# EAGLE board PCB (EAGLE 9.6.2), part 1 of 2
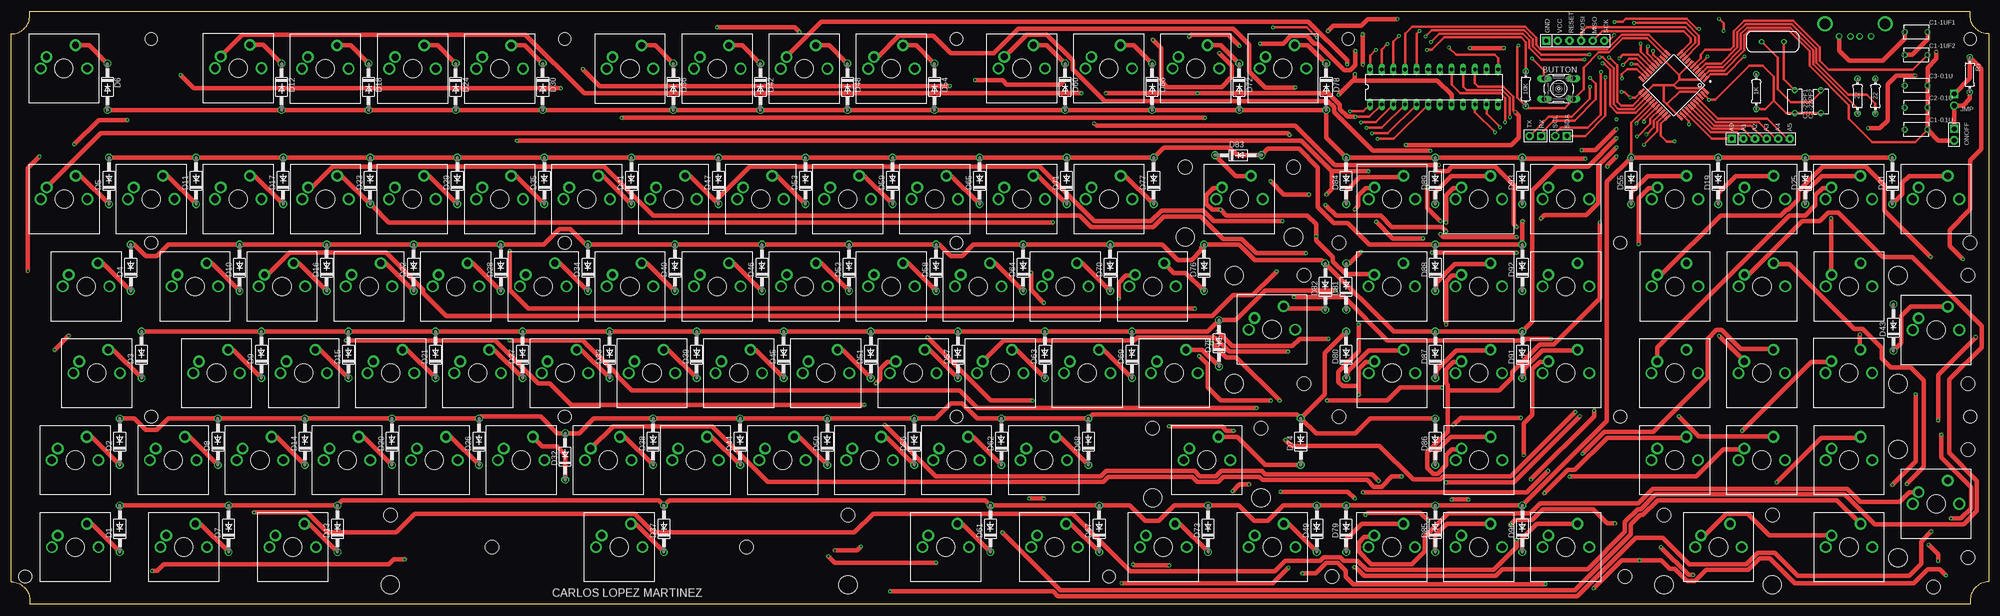
[diagram p2: board, top side]
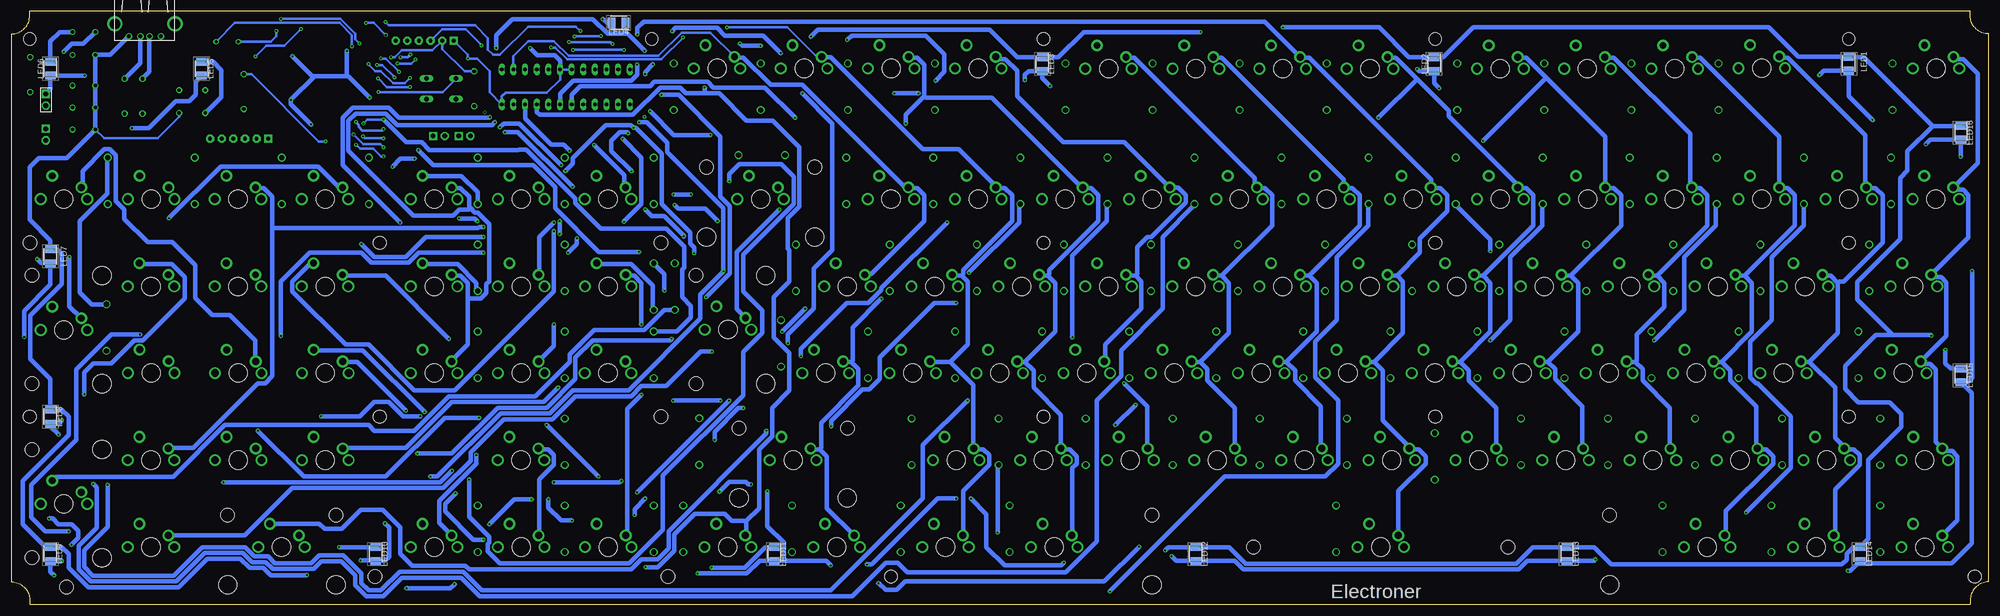
[diagram p3: board, bottom side, seen from below]

Size 431.5 x 129.5 mm. Coordinates in mm from the lower left corner, seen from the top.
Outline: 431.5,124.6 431.5,4.9 arc90 427.5,0.9 427.5,0 4,0 4,0.9 arc90 0,4.9 0,124.6 arc90 4,128.6 4,129.5 427.5,129.5 427.5,128.6 arc90 431.5,124.6
Copper layers (1*16): Top 0.035mm / dielectric 1.5mm / Bottom 0.035mm
Design rules "default *": minimum track width 0.5mm, minimum drill 0.35mm, track to track 10mil, track to pad 10mil, pad to pad 7mil, via to via 10mil, smd to smd 7mil, copper to edge 40mil, drill to drill 6mil, minimum pad ring 10mil, minimum via ring 8mil, stop-mask expansion 4mil, vias tented up to drill 0mil, thermal gap 10mil
Net classes: 0 default: width 0.203 mm
Holes 2.75 mm at 30.5,123.47 120.75,123.47 206.25,123.46 291.75,123.46 427.5,123.47
Holes 2.8 mm at 351.13,79 427.5,41 351.13,41 239.5,6.04 3,6.03 30.51,78.99 120.75,79 206.25,78.99 206.26,41 120.76,41 30.5,40.99
Holes 3 mm at 82.7,19.5 182.55,19.5 384.32,19.5 360.68,19.5 427,33.82 427,10.18 427,48.18 427,71.83 272.7,38.5 249.05,38.5 282.13,48.18 282.12,71.83 279.82,95.5 256.18,95.5 289.75,78.99 419.5,3.78 352.16,6.04 288.19,6.04 289.75,41 160.43,12.5 104.83,12.5 427.5,79
Holes 4 mm at 82.7,4.25 182.57,4.25 384.32,4.25 360.68,4.24 411.74,10.17 411.74,33.82 411.74,48.18 411.75,71.82 272.7,23.25 249.05,23.25 266.87,48.18 266.87,71.83 256.18,80.25 279.82,80.24

## Footprints (pad centres in the part's own frame; a part is rotated, then mirrored left to right if it is on the bottom)
SIP-100-06-32 = drill 0.813 pad 1.778 square: 1 -6.35,0 | drill 0.813 pad 1.778 octagon: 2 -3.81,0; 3 -1.27,0; 4 1.27,0; 5 3.81,0; 6 6.35,0
B3F-10XX = drill 1.016 long: 1 -3.251,2.261; 2 3.251,2.261; 3 -3.251,-2.261; 4 3.251,-2.261
CAP_RDE5C1H273J2M1H03A = drill 0.75 pad 1.15: 1 -2.5,0; 2 2.5,0
DO41-10 = drill 1.118: A 5.08,0; C -5.08,0
CHERRY-MX = drill 1.714 pad 1.93: P$3 -5.08,0; P$4 5.08,0 | drill 1.5 pad 2.54: SW1 -3.81,2.54; SW2 2.54,5.08 | hole 4: 0,0
LEDM3528X200N = smd 1.65 x 2.25: 1 -1.5,0; 2 1.5,0
SIP-100-02-40 = drill 1.016 pad 1.778 square: 1 -1.27,0 | drill 1.016 pad 1.778 octagon: 2 1.27,0
DIL24-3 = drill 0.813 long: 1 -13.97,-3.81; 2 -11.43,-3.81; 3 -8.89,-3.81; 4 -6.35,-3.81; 5 -3.81,-3.81; 6 -1.27,-3.81; 7 1.27,-3.81; 8 3.81,-3.81; 9 6.35,-3.81; 10 8.89,-3.81; 11 11.43,-3.81; 12 13.97,-3.81; 13 13.97,3.81; 14 11.43,3.81; 15 8.89,3.81; 16 6.35,3.81; 17 3.81,3.81; 18 1.27,3.81; 19 -1.27,3.81; 20 -3.81,3.81; 21 -6.35,3.81; 22 -8.89,3.81; 23 -11.43,3.81; 24 -13.97,3.81
0204/7 = drill 0.813 octagon: 1 -3.81,0; 2 3.81,0
QFP80P1200X1200X120-44N = smd 1.5 x 0.5: 1 -5.9,4; 2 -5.9,3.2; 3 -5.9,2.4; 4 -5.9,1.6; 5 -5.9,0.8; 6 -5.9,0; 7 -5.9,-0.8; 8 -5.9,-1.6; 9 -5.9,-2.4; 10 -5.9,-3.2; 11 -5.9,-4; 23 5.9,-4; 24 5.9,-3.2; 25 5.9,-2.4; 26 5.9,-1.6; 27 5.9,-0.8; 28 5.9,0; 29 5.9,0.8; 30 5.9,1.6; 31 5.9,2.4; 32 5.9,3.2; 33 5.9,4 | smd 0.5 x 1.5: 12 -4,-5.9; 13 -3.2,-5.9; 14 -2.4,-5.9; 15 -1.6,-5.9; 16 -0.8,-5.9; 17 0,-5.9; 18 0.8,-5.9; 19 1.6,-5.9; 20 2.4,-5.9; 21 3.2,-5.9; 22 4,-5.9; 34 4,5.9; 35 3.2,5.9; 36 2.4,5.9; 37 1.6,5.9; 38 0.8,5.9; 39 0,5.9; 40 -0.8,5.9; 41 -1.6,5.9; 42 -2.4,5.9; 43 -3.2,5.9; 44 -4,5.9
USB-A-H = drill 0.914: D+ 2.718,-1.003; D- 2.718,1.003; GND 2.718,-3.493; VBUS 2.718,3.493 | drill 2.311: P$5 0,-6.566; P$6 0,6.566
XTAL_ECS-160-20-4X = drill 0.63 pad 1.03: 1 -2.44,0; 2 2.44,0

## Placement (x,y rotation side)
ANALOG  Boot  [SIP-100-06-32]  381.8,101.7 0 top
BUTTON  [B3F-10XX]  337.7,112.6 0 top
C1-0.1U  RDE5C1H273J2M1H03A  [CAP_RDE5C1H273J2M1H03A]  415.7,103.7 180 top
C1-1UF1  RDE5C1H273J2M1H03A  [CAP_RDE5C1H273J2M1H03A]  415.7,125 0 top
C1-1UF2  RDE5C1H273J2M1H03A  [CAP_RDE5C1H273J2M1H03A]  415.7,120 180 top
C1-22PF1  RDE5C1H273J2M1H03A  [CAP_RDE5C1H273J2M1H03A]  389.2,109.8 270 top
C1-22PF2  RDE5C1H273J2M1H03A  [CAP_RDE5C1H273J2M1H03A]  394.9,109.8 270 top
C2-0.1U  RDE5C1H273J2M1H03A  [CAP_RDE5C1H273J2M1H03A]  415.7,108.5 180 top
C3-0.1U  RDE5C1H273J2M1H03A  [CAP_RDE5C1H273J2M1H03A]  415.7,113.3 180 top
D1  1N4004  [DO41-10]  23.65,16.5 90 top
D2  1N4004  [DO41-10]  23.65,35.5 90 top
D3  1N4004  [DO41-10]  28.4,54.5 90 top
D4  1N4004  [DO41-10]  26.05,73.5 90 top
D5  1N4004  [DO41-10]  21.3,92.5 90 top
D6  1N4004  [DO41-10]  20.95,113.05 270 top
D7  1N4004  [DO41-10]  47.4,16.5 90 top
D8  1N4004  [DO41-10]  45.05,35.5 90 top
D9  1N4004  [DO41-10]  54.55,54.5 90 top
D10  1N4004  [DO41-10]  49.8,73.5 90 top
D11  1N4004  [DO41-10]  40.3,92.5 90 top
D12  1N4004  [DO41-10]  58.95,113.05 270 top
D13  1N4004  [DO41-10]  71.15,16.5 90 top
D14  1N4004  [DO41-10]  64.05,35.5 90 top
D15  1N4004  [DO41-10]  73.55,54.5 90 top
D16  1N4004  [DO41-10]  68.8,73.5 90 top
D17  1N4004  [DO41-10]  59.3,92.5 90 top
D18  1N4004  [DO41-10]  77.95,113.05 270 top
D19  1N4004  [DO41-10]  372.5,92.5 90 top
D20  1N4004  [DO41-10]  83.05,35.5 90 top
D21  1N4004  [DO41-10]  92.55,54.5 90 top
D22  1N4004  [DO41-10]  87.8,73.5 90 top
D23  1N4004  [DO41-10]  78.3,92.5 90 top
D24  1N4004  [DO41-10]  96.95,113.05 270 top
D25  1N4004  [DO41-10]  391.5,92.5 90 top
D26  1N4004  [DO41-10]  102.05,35.5 90 top
D27  1N4004  [DO41-10]  111.55,54.5 90 top
D28  1N4004  [DO41-10]  106.8,73.5 90 top
D29  1N4004  [DO41-10]  97.3,92.5 90 top
D30  1N4004  [DO41-10]  115.95,113.05 270 top
D31  1N4004  [DO41-10]  410.5,92.5 90 top
D32  1N4004  [DO41-10]  120.85,32.3 90 top
D33  1N4004  [DO41-10]  130.55,54.5 90 top
D34  1N4004  [DO41-10]  125.8,73.5 90 top
D35  1N4004  [DO41-10]  116.3,92.5 90 top
D36  1N4004  [DO41-10]  144.45,113.05 270 top
D37  1N4004  [DO41-10]  142.4,16.5 90 top
D38  1N4004  [DO41-10]  140.05,35.5 90 top
D39  1N4004  [DO41-10]  149.55,54.5 90 top
D40  1N4004  [DO41-10]  144.8,73.5 90 top
D41  1N4004  [DO41-10]  135.3,92.5 90 top
D42  1N4004  [DO41-10]  163.45,113.05 270 top
D43  1N4004  [DO41-10]  410.75,60.45 90 top
D44  1N4004  [DO41-10]  159.05,35.5 90 top
D45  1N4004  [DO41-10]  168.55,54.5 90 top
D46  1N4004  [DO41-10]  163.8,73.5 90 top
D47  1N4004  [DO41-10]  154.3,92.5 90 top
D48  1N4004  [DO41-10]  182.45,113.05 270 top
D49  1N4004  [DO41-10]  284.9,16.5 90 top
D50  1N4004  [DO41-10]  178.05,35.5 90 top
D51  1N4004  [DO41-10]  187.55,54.5 90 top
D52  1N4004  [DO41-10]  182.8,73.5 90 top
D53  1N4004  [DO41-10]  173.3,92.5 90 top
D54  1N4004  [DO41-10]  201.45,113.05 270 top
D55  1N4004  [DO41-10]  353.5,92.5 90 top
D56  1N4004  [DO41-10]  197.05,35.5 90 top
D57  1N4004  [DO41-10]  206.55,54.5 90 top
D58  1N4004  [DO41-10]  201.8,73.5 90 top
D59  1N4004  [DO41-10]  192.3,92.5 90 top
D60  1N4004  [DO41-10]  229.95,113.05 270 top
D61  1N4004  [DO41-10]  213.65,16.5 90 top
D62  1N4004  [DO41-10]  216.05,35.5 90 top
D63  1N4004  [DO41-10]  225.55,54.5 90 top
D64  1N4004  [DO41-10]  220.8,73.5 90 top
D65  1N4004  [DO41-10]  211.3,92.5 90 top
D66  1N4004  [DO41-10]  248.95,113.05 270 top
D67  1N4004  [DO41-10]  237.4,16.5 90 top
D68  1N4004  [DO41-10]  235.05,35.5 90 top
D69  1N4004  [DO41-10]  244.55,54.5 90 top
D70  1N4004  [DO41-10]  239.8,73.5 90 top
D71  1N4004  [DO41-10]  230.3,92.5 90 top
D72  1N4004  [DO41-10]  267.95,113.05 270 top
D73  1N4004  [DO41-10]  261.15,16.5 90 top
D74  1N4004  [DO41-10]  281.4,35.55 90 top
D75  1N4004  [DO41-10]  263.55,57 90 top
D76  1N4004  [DO41-10]  260.3,73.5 90 top
D77  1N4004  [DO41-10]  249.3,92.5 90 top
D78  1N4004  [DO41-10]  286.95,113.05 270 top
D79  1N4004  [DO41-10]  291.3,16.5 90 top
D80  1N4004  [DO41-10]  291.3,54.5 90 top
D81  1N4004  [DO41-10]  291.3,69.4 90 top
D82  1N4004  [DO41-10]  286.75,69.4 90 top
D83  1N4004  [DO41-10]  267.75,98.1 0 top
D84  1N4004  [DO41-10]  291.3,92.5 90 top
D85  1N4004  [DO41-10]  310.75,16.5 90 top
D86  1N4004  [DO41-10]  310.75,35.5 90 top
D87  1N4004  [DO41-10]  310.75,54.5 90 top
D88  1N4004  [DO41-10]  310.75,73.5 90 top
D89  1N4004  [DO41-10]  310.75,92.5 90 top
D90  1N4004  [DO41-10]  329.75,16.5 90 top
D91  1N4004  [DO41-10]  329.75,54.5 90 top
D92  1N4004  [DO41-10]  329.75,73.5 90 top
D93  1N4004  [DO41-10]  329.75,92.5 90 top
DUPLICADO1  CHERRY-MX  [CHERRY-MX]  363,31.5 0 top
DUPLICADO2  CHERRY-MX  [CHERRY-MX]  382,31.5 0 top
DUPLICADO3  CHERRY-MX  [CHERRY-MX]  401.05,31.5 0 top
DUPLICADO4  CHERRY-MX  [CHERRY-MX]  363,50.5 0 top
DUPLICADO5  CHERRY-MX  [CHERRY-MX]  382,50.5 0 top
DUPLICADO6  CHERRY-MX  [CHERRY-MX]  401,50.55 0 top
DUPLICADO7  CHERRY-MX  [CHERRY-MX]  363.05,69.45 0 top
DUPLICADO8  CHERRY-MX  [CHERRY-MX]  382.05,69.45 0 top
DUPLICADO9  CHERRY-MX  [CHERRY-MX]  401.05,69.45 0 top
DUPLICADO10  CHERRY-MX  [CHERRY-MX]  372.55,12.5 0 top
ENTERDUPLICADO  CHERRY-MX  [CHERRY-MX]  420.05,21.95 0 top
J3  Boot  [SIP-100-06-32]  341.3,123.1 0 top
LED1  ASMM-CA03-AS402  [LEDM3528X200N]  30.49,118.06 270 bottom
LED2  ASMM-CA03-AS402  [LEDM3528X200N]  121,118 270 bottom
LED3  ASMM-CA03-AS402  [LEDM3528X200N]  206.5,118 270 bottom
LED4  ASMM-CA03-AS402  [LEDM3528X200N]  299,127 180 bottom
LED5  ASMM-CA03-AS402  [LEDM3528X200N]  390,117 270 bottom
LED6  ASMM-CA03-AS402  [LEDM3528X200N]  423,117 270 bottom
LED7  ASMM-CA03-AS402  [LEDM3528X200N]  423,76 270 bottom
LED8  ASMM-CA03-AS402  [LEDM3528X200N]  423,41 270 bottom
LED9  ASMM-CA03-AS402  [LEDM3528X200N]  423,11 270 bottom
LED10  ASMM-CA03-AS402  [LEDM3528X200N]  352,11 270 bottom
LED11  ASMM-CA03-AS402  [LEDM3528X200N]  265,11 270 bottom
LED12  ASMM-CA03-AS402  [LEDM3528X200N]  173,11 270 bottom
LED13  ASMM-CA03-AS402  [LEDM3528X200N]  92,11 270 bottom
LED14  ASMM-CA03-AS402  [LEDM3528X200N]  28,11 270 bottom
LED15  ASMM-CA03-AS402  [LEDM3528X200N]  6,50 270 bottom
LED16  ASMM-CA03-AS402  [LEDM3528X200N]  6,103 270 bottom
LEDSJUMPER  F-1X02-SIP-100-40  [SIP-100-02-40]  424,110.2 270 bottom
MULTIPLEXOR  74154N  [DIL24-3]  310.5,113 0 top
ONOFF  F-1X02-SIP-100-40  [SIP-100-02-40]  424,102.6 270 top
PUNTODUPLICADO  CHERRY-MX  [CHERRY-MX]  401.05,12.5 0 top
R1  22  [0204/7]  406.8,111 90 top
R2  22  [0204/7]  402.9,111 90 top
R3  1K  [0204/7]  427.4,115.7 270 top
R4  1K  [0204/7]  380.8,112 90 top
R5  10K  [0204/7]  330.5,112.6 270 top
RXTX  F-1X02-SIP-100-40  [SIP-100-02-40]  332.6,102.3 180 top
SD  F-1X02-SIP-100-40  [SIP-100-02-40]  338.2,102.3 180 top
U1  ATMEGA32U4-AU  [QFP80P1200X1200X120-44N]  362.8,113.4 225 top
U$1  CHERRY-MX  [CHERRY-MX]  13.91,12.49 0 top
U$2  CHERRY-MX  [CHERRY-MX]  13.9,31.5 0 top
U$3  CHERRY-MX  [CHERRY-MX]  18.6,50.5 0 top
U$4  CHERRY-MX  [CHERRY-MX]  16.3,69.45 0 top
U$5  CHERRY-MX  [CHERRY-MX]  11.5,88.5 0 top
U$6  CHERRY-MX  [CHERRY-MX]  11.45,117.05 0 top
U$7  CHERRY-MX  [CHERRY-MX]  37.6,12.5 0 top
U$8  CHERRY-MX  [CHERRY-MX]  35.3,31.5 0 top
U$9  CHERRY-MX  [CHERRY-MX]  44.75,50.5 0 top
U$10  CHERRY-MX  [CHERRY-MX]  40.05,69.45 0 top
U$11  CHERRY-MX  [CHERRY-MX]  30.5,88.5 0 top
U$12  CHERRY-MX  [CHERRY-MX]  49.5,117.1 0 top
U$13  CHERRY-MX  [CHERRY-MX]  61.4,12.5 0 top
U$14  CHERRY-MX  [CHERRY-MX]  54.25,31.5 0 top
U$15  CHERRY-MX  [CHERRY-MX]  63.8,50.5 0 top
U$16  CHERRY-MX  [CHERRY-MX]  59.05,69.45 0 top
U$17  CHERRY-MX  [CHERRY-MX]  49.5,88.5 0 top
U$18  CHERRY-MX  [CHERRY-MX]  68.5,117 0 top
U$19  CHERRY-MX  [CHERRY-MX]  382.05,88.5 0 top
U$20  CHERRY-MX  [CHERRY-MX]  73.25,31.5 0 top
U$21  CHERRY-MX  [CHERRY-MX]  82.8,50.5 0 top
U$22  CHERRY-MX  [CHERRY-MX]  78.05,69.45 0 top
U$23  CHERRY-MX  [CHERRY-MX]  68.55,88.5 0 top
U$24  CHERRY-MX  [CHERRY-MX]  87.55,117 0 top
U$25  CHERRY-MX  [CHERRY-MX]  401,88.5 0 top
U$26  CHERRY-MX  [CHERRY-MX]  92.3,31.5 0 top
U$27  CHERRY-MX  [CHERRY-MX]  101.75,50.5 0 top
U$28  CHERRY-MX  [CHERRY-MX]  97,69.45 0 top
U$29  CHERRY-MX  [CHERRY-MX]  87.5,88.5 0 top
U$30  CHERRY-MX  [CHERRY-MX]  106.55,117 0 top
U$31  CHERRY-MX  [CHERRY-MX]  420.05,88.5 0 top
U$32  CHERRY-MX  [CHERRY-MX]  111.25,31.5 0 top
U$33  CHERRY-MX  [CHERRY-MX]  120.8,50.5 0 top
U$34  CHERRY-MX  [CHERRY-MX]  116.05,69.45 0 top
U$35  CHERRY-MX  [CHERRY-MX]  106.55,88.5 0 top
U$36  CHERRY-MX  [CHERRY-MX]  135,117 0 top
U$37  CHERRY-MX  [CHERRY-MX]  132.65,12.5 0 top
U$38  CHERRY-MX  [CHERRY-MX]  130.25,31.5 0 top
U$39  CHERRY-MX  [CHERRY-MX]  139.8,50.5 0 top
U$40  CHERRY-MX  [CHERRY-MX]  135,69.45 0 top
U$41  CHERRY-MX  [CHERRY-MX]  125.55,88.5 0 top
U$42  CHERRY-MX  [CHERRY-MX]  154.05,117 0 top
U$43  CHERRY-MX  [CHERRY-MX]  420.05,59.95 0 top
U$44  CHERRY-MX  [CHERRY-MX]  149.3,31.5 0 top
U$45  CHERRY-MX  [CHERRY-MX]  158.75,50.5 0 top
U$46  CHERRY-MX  [CHERRY-MX]  154.05,69.45 0 top
U$47  CHERRY-MX  [CHERRY-MX]  144.5,88.5 0 top
U$48  CHERRY-MX  [CHERRY-MX]  173,117 0 top
U$49  CHERRY-MX  [CHERRY-MX]  275.15,12.5 0 top
U$50  CHERRY-MX  [CHERRY-MX]  168.3,31.5 0 top
U$51  CHERRY-MX  [CHERRY-MX]  177.75,50.5 0 top
U$52  CHERRY-MX  [CHERRY-MX]  173.05,69.45 0 top
U$53  CHERRY-MX  [CHERRY-MX]  163.5,88.5 0 top
U$54  CHERRY-MX  [CHERRY-MX]  192.05,117 0 top
U$55  CHERRY-MX  [CHERRY-MX]  363.05,88.5 0 top
U$56  CHERRY-MX  [CHERRY-MX]  187.3,31.5 0 top
U$57  CHERRY-MX  [CHERRY-MX]  196.8,50.5 0 top
U$58  CHERRY-MX  [CHERRY-MX]  192.05,69.45 0 top
U$59  CHERRY-MX  [CHERRY-MX]  182.5,88.5 0 top
U$60  CHERRY-MX  [CHERRY-MX]  220.5,117.05 0 top
U$61  CHERRY-MX  [CHERRY-MX]  203.9,12.5 0 top
U$62  CHERRY-MX  [CHERRY-MX]  206.25,31.5 0 top
U$63  CHERRY-MX  [CHERRY-MX]  215.8,50.5 0 top
U$64  CHERRY-MX  [CHERRY-MX]  211,69.45 0 top
U$65  CHERRY-MX  [CHERRY-MX]  201.5,88.5 0 top
U$66  CHERRY-MX  [CHERRY-MX]  239.5,117.05 0 top
U$67  CHERRY-MX  [CHERRY-MX]  227.65,12.5 0 top
U$68  CHERRY-MX  [CHERRY-MX]  225.3,31.5 0 top
U$69  CHERRY-MX  [CHERRY-MX]  234.8,50.5 0 top
U$70  CHERRY-MX  [CHERRY-MX]  230,69.45 0 top
U$71  CHERRY-MX  [CHERRY-MX]  220.5,88.5 0 top
U$72  CHERRY-MX  [CHERRY-MX]  258.5,117.05 0 top
U$73  CHERRY-MX  [CHERRY-MX]  251.4,12.5 0 top
U$74  CHERRY-MX  [CHERRY-MX]  260.9,31.5 0 top
U$75  CHERRY-MX  [CHERRY-MX]  253.8,50.5 0 top
U$76  CHERRY-MX  [CHERRY-MX]  249.05,69.45 0 top
U$77  CHERRY-MX  [CHERRY-MX]  239.55,88.5 0 top
U$78  CHERRY-MX  [CHERRY-MX]  277.5,117.05 0 top
U$79  CHERRY-MX  [CHERRY-MX]  301.25,12.5 0 top
U$80  CHERRY-MX  [CHERRY-MX]  301.3,50.5 0 top
U$81  CHERRY-MX  [CHERRY-MX]  301.25,69.45 0 top
U$82  CHERRY-MX  [CHERRY-MX]  275.1,60 0 top
U$83  CHERRY-MX  [CHERRY-MX]  268,88.5 0 top
U$84  CHERRY-MX  [CHERRY-MX]  301.3,88.5 0 top
U$85  CHERRY-MX  [CHERRY-MX]  320.25,12.5 0 top
U$86  CHERRY-MX  [CHERRY-MX]  320.3,31.5 0 top
U$87  CHERRY-MX  [CHERRY-MX]  320.25,50.5 0 top
U$88  CHERRY-MX  [CHERRY-MX]  320.25,69.45 0 top
U$89  CHERRY-MX  [CHERRY-MX]  320.25,88.5 0 top
U$90  CHERRY-MX  [CHERRY-MX]  339.25,12.5 0 top
U$91  CHERRY-MX  [CHERRY-MX]  339.25,50.5 0 top
U$92  CHERRY-MX  [CHERRY-MX]  339.25,69.45 0 top
U$93  CHERRY-MX  [CHERRY-MX]  339.25,88.5 0 top
X2  USB-A-H  [USB-A-H]  402.38,126.8 270 bottom
Y1  ECS-160-20-4X  [XTAL_ECS-160-20-4X]  384.4,122.9 180 top